# EAGLE design avr_programming_shield_Zif-Ken (EAGLE 6.3)
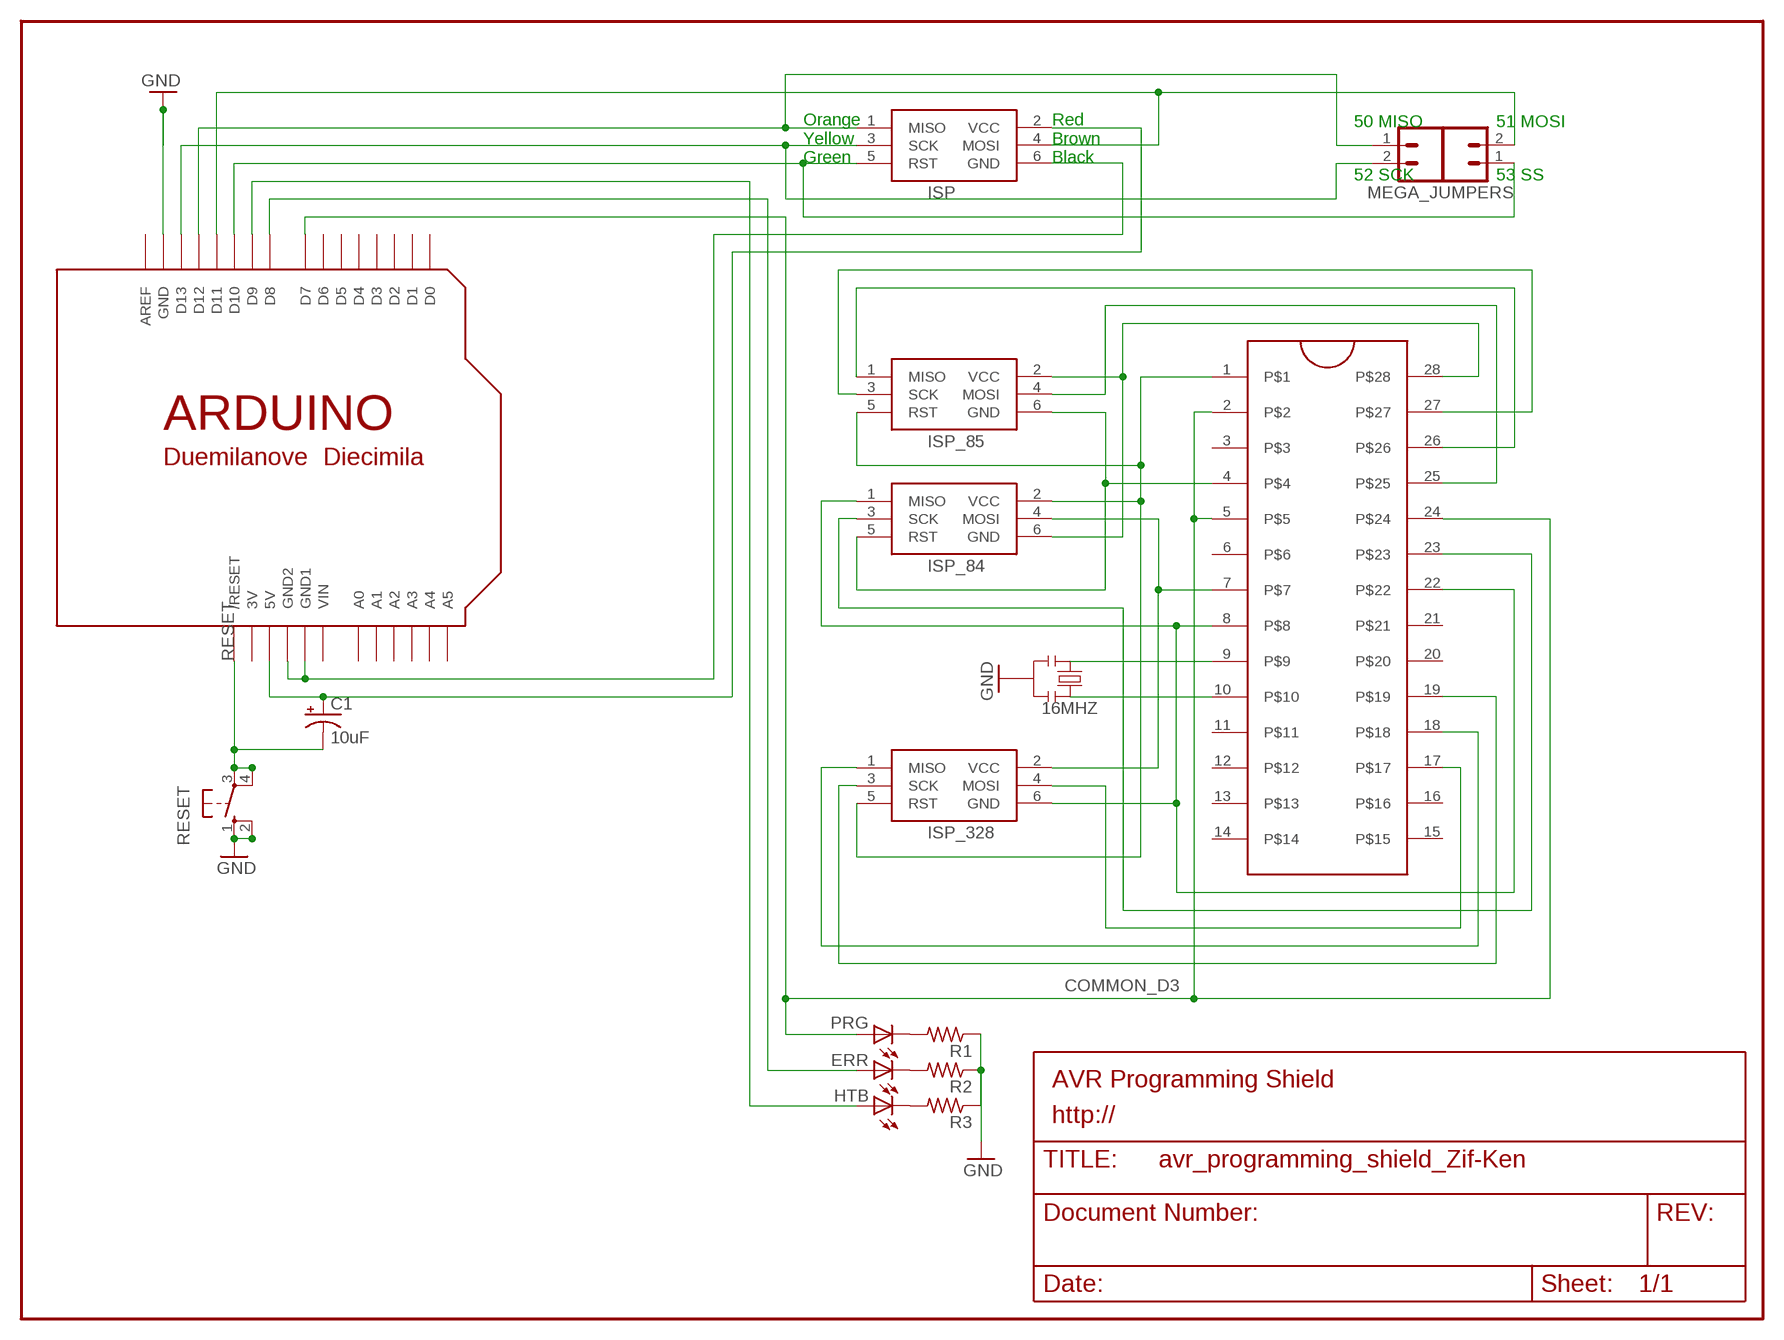
[diagram p0: schematic, sheet 1]

## Parts
16MHZ  RESONATORPTH  [RESONATOR-PTH]
C1  10uF  CAP_POLPTH2  [CPOL-RADIAL-10UF-25V]
ERR  LED3MM  [LED3MM]
HTB  LED3MM  [LED3MM]
ISP  AVRISP-6  [AVRISP]
ISP_84  AVRISP-6  [AVRISP]
ISP_85  AVRISP-6  [AVRISP]
ISP_328  AVRISP-6  [AVRISP]
JP2  M02PTH  [1X02]
MEGA_JUMPERS  M02PTH  [1X02]
PRG  LED3MM  [LED3MM]
R1  R-US_0204/2V  [0204V]
R2  R-US_0204/2V  [0204V]
R3  R-US_0204/2V  [0204V]
RESET  10-XX  [B3F-10XX]
U$1  ARDUINO-NOHOLE  [ARDUINO-NOHOLE]
U$3  ZIFSOCKET-28-3ZIFFSOCKET-28-3  [DIL28-3-ZIF_SOCKET]

## Nets
COMMON_D3: PRG.A U$1.D7 U$3.2 U$3.5 U$3.24
GND [power]: 16MHZ.2 ISP.6(GND) R1.1 R2.1 R3.1 RESET.1(S) RESET.2(S1) U$1.GND U$1.GND1 U$1.GND2
N$1: ISP_328.4(MOSI) U$3.17
N$2: ISP.3(SCK) MEGA_JUMPERS.2 U$1.D13
N$3: ISP.1(MISO) MEGA_JUMPERS.1 U$1.D12
N$4: ISP_328.1(MISO) U$3.18
N$5: ISP.5(RST) JP2.1 U$1.D10
N$6: ISP.4(MOSI) JP2.2 U$1.D11
N$7: ISP_328.3(SCK) U$3.19
N$8: PRG.K(C) R1.2
N$9: ERR.K(C) R2.2
N$10: HTB.K(C) R3.2
N$11: ISP_84.4(MOSI) ISP_328.2(VCC) U$3.7
N$13: ISP_84.2(VCC) ISP_85.5(RST) ISP_328.5(RST) U$3.1
N$15: ISP_84.3(SCK) U$3.23
N$16: ISP_84.6(GND) ISP_85.2(VCC) U$3.28
N$17: HTB.A U$1.D9
N$18: ISP_84.5(RST) ISP_85.6(GND) U$3.4
N$19: ISP_85.4(MOSI) U$3.25
N$20: ISP_85.1(MISO) U$3.26
N$21: ISP_85.3(SCK) U$3.27
N$22: 16MHZ.1 U$3.9
N$24: ERR.A U$1.D8
N$25: 16MHZ.3 U$3.10
N$26: ISP_84.1(MISO) ISP_328.6(GND) U$3.8 U$3.22
RESET: C1.2(-) RESET.3(P) RESET.4(P1) U$1.RESET(/RESET)
VCC: C1.1(+) ISP.2(VCC) U$1.5V
Unconnected: U$1.A0 U$1.A1 U$1.A2 U$1.A3 U$1.A4 U$1.A5 U$1.AREF U$1.D0 U$1.D1 U$1.D2 U$1.D3 U$1.D4 U$1.D5 U$1.D6 U$3.3 U$3.6 U$3.11 U$3.12 U$3.13 U$3.14 U$3.15 U$3.16 U$3.20 U$3.21

## Notes on the sheet
- 50 MISO | 51 MOSI
- Orange
  Yellow
  Green
- Red
  Brown
  Black
- 52 SCK | 53 SS
- AVR Programming Shield
- http://

## Power pins joined to a net without a drawn wire
3V: U$1.3V
VIN: U$1.VIN

## Library data of the parts
16MHZ = SparkFun_mod:RESONATOR: Resonator Small SMD resonator. This is the itty bitty 10/20MHz resonators with built in caps. CSTCE10M0G55 and CSTCE20M0V53. Footprint has been reviewed closely but hasn't been tested yet.
C1 = SparkFun:CAP_POL: Capacitor Polarized These are standard SMD and PTH capacitors. Normally 10uF, 47uF, and 100uF in electrolytic and tantalum varieties. Always verify the external diameter of the through hole cap, it varies with capacity, voltage, and manufacturer. The EIA devices should be standard.
ERR HTB PRG = adafruit:LED: LED OSRAM: - CHIPLED LG R971, LG N971, LY N971, LG Q971, LY Q971, LO R971, LY R971 LH N974, LH R974 LS Q976, LO Q976, LY Q976 LO Q996 - Hyper CHIPLED LW Q18S LB Q993, LB Q99A, LB R99A - SideLED LS A670, LO A670, LY A670, LG A670, LP A670 LB A673, LV A673, LT A673, LW A673 LH A674 LY A675 LS A676, LA A676, LO A676, LY A676, LW A676 LS A679, LY A679, LG A679 - Hyper Micro SIDELED® LS Y876, LA Y876, LO Y876, LY Y876 LT Y87S - SmartLED LW L88C, LW L88S LB L89C, LB L89S, LG L890 LS L89K, LO L89K, LY L89K LS L896, LA L896, LO L896, LY L896 - TOPLED LS T670, LO T670, LY T670, LG T670, LP T670 LSG T670, LSP T670, LSY T670, LOP T670, LYG T670 LG T671, LOG T671, LSG T671 LB T673, LV T673, LT T673, LW T673 LH T674 LS T676, LA T676, LO T676, LY T676, LB T676, LH T676, LSB T676, LW T676 LB T67C, LV T67C, LT T67C, LS T67K, LO T67K, LY T67K, LW E67C LS E67B, LA E67B, LO E67B, LY E67B, LB E67C, LV E67C, LT E67C LW T67C LS T679, LY T679, LG T679 LS T770, LO T770, LY T770, LG T770, LP T770 LB T773, LV T773, LT T773, LW T773 LH T774 LS E675, LA E675, LY E675, LS T675 LS T776, LA T776, LO T776, LY T776, LB T776 LHGB T686 LT T68C, LB T68C - Hyper Mini TOPLED® LB M676 - Mini TOPLED Santana® LG M470 LS M47K, LO M47K, LY M47K Source: http://www.osram.convergy.de/
ISP ISP_84 ISP_85 ISP_328 = adafruit:AVRISP: AVR ISP HEADER Standard 6 pin header for AVR programming
JP2 MEGA_JUMPERS = SparkFun:M02: Header 2 Standard 2-pin 0.1" header. Use with straight break away headers (SKU : PRT-00116), right angle break away headers (PRT-00553), swiss pins (PRT-00743), machine pins (PRT-00117), and female headers (PRT-00115). Molex polarized connector foot print use with SKU : PRT-08233 with associated crimp pins and housings.
R1-R3 = adafruit:R-US_: RESISTOR, American symbol
RESET = switch-omron:10-XX: OMRON SWITCH
U$1 = adafruit:ARDUINO: Arduino Diecimila/Duemilanove Make a shield with ease, this package has all the named pins as well as the two mounting drill holes and an outline of the USB and DC power connector. The outline is on the DIMENSION layer, so if your board house uses it they will cut the outline to match. http://www.ladyada.net/library/pcb/eaglelibrary.html
U$3 = SparkFun-Connectors_mod:ZIFSOCKET-28-3: Lever-action ZIF socket for 28-pin ICs

## Net classes
1 power: width 0.61 mm

## Board
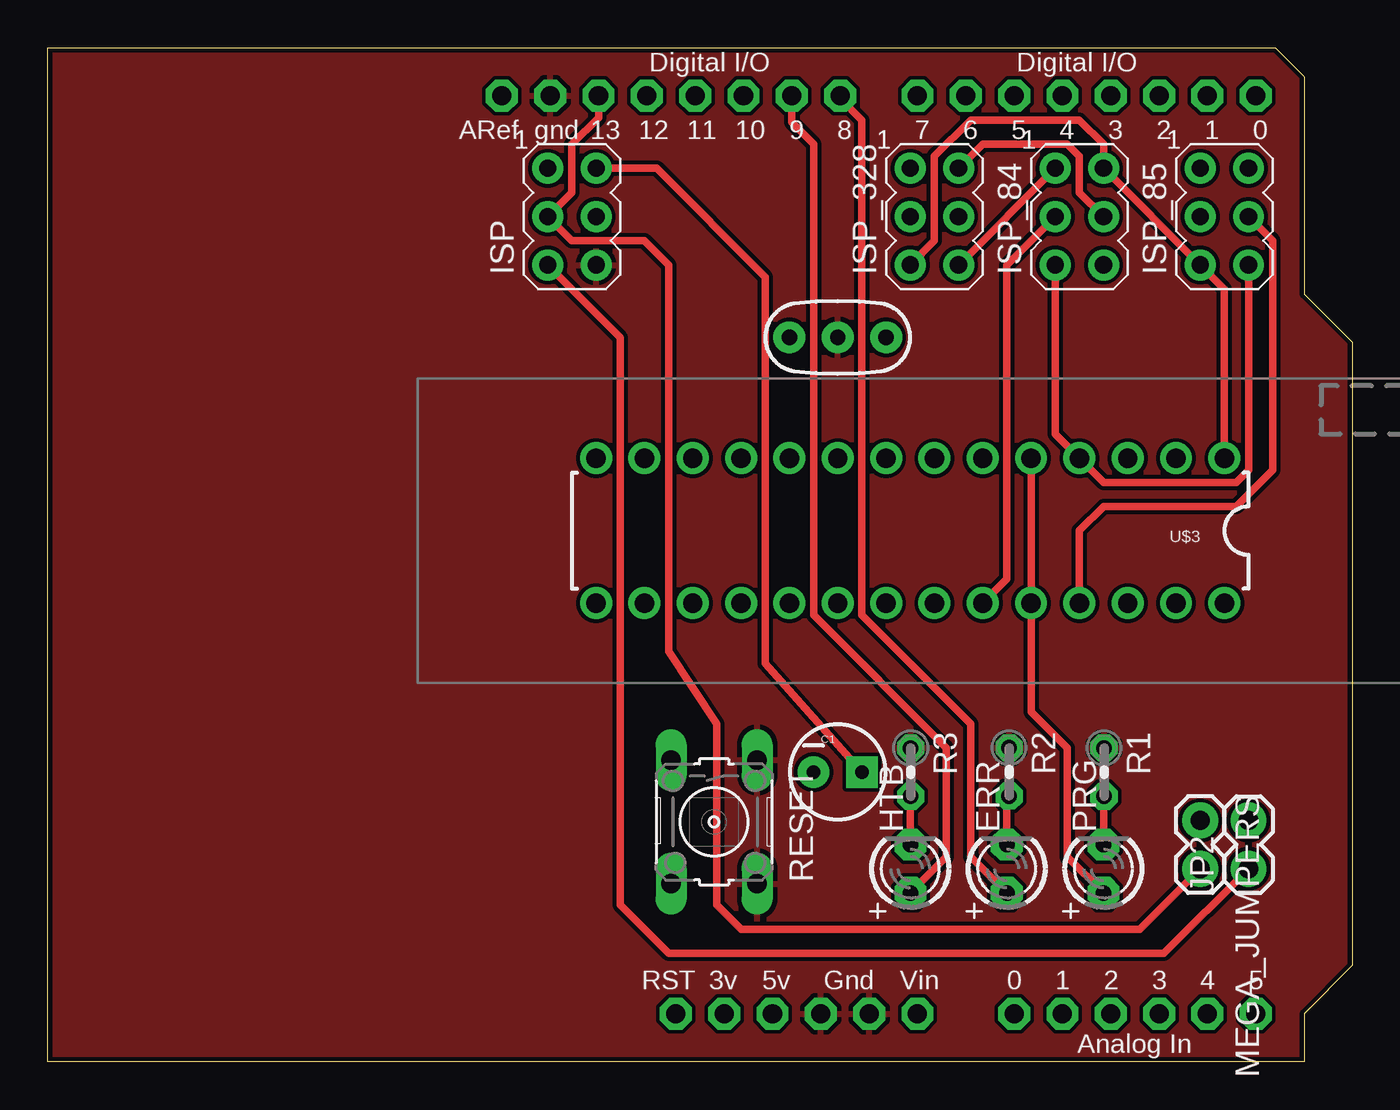
[diagram p1: board, top side]
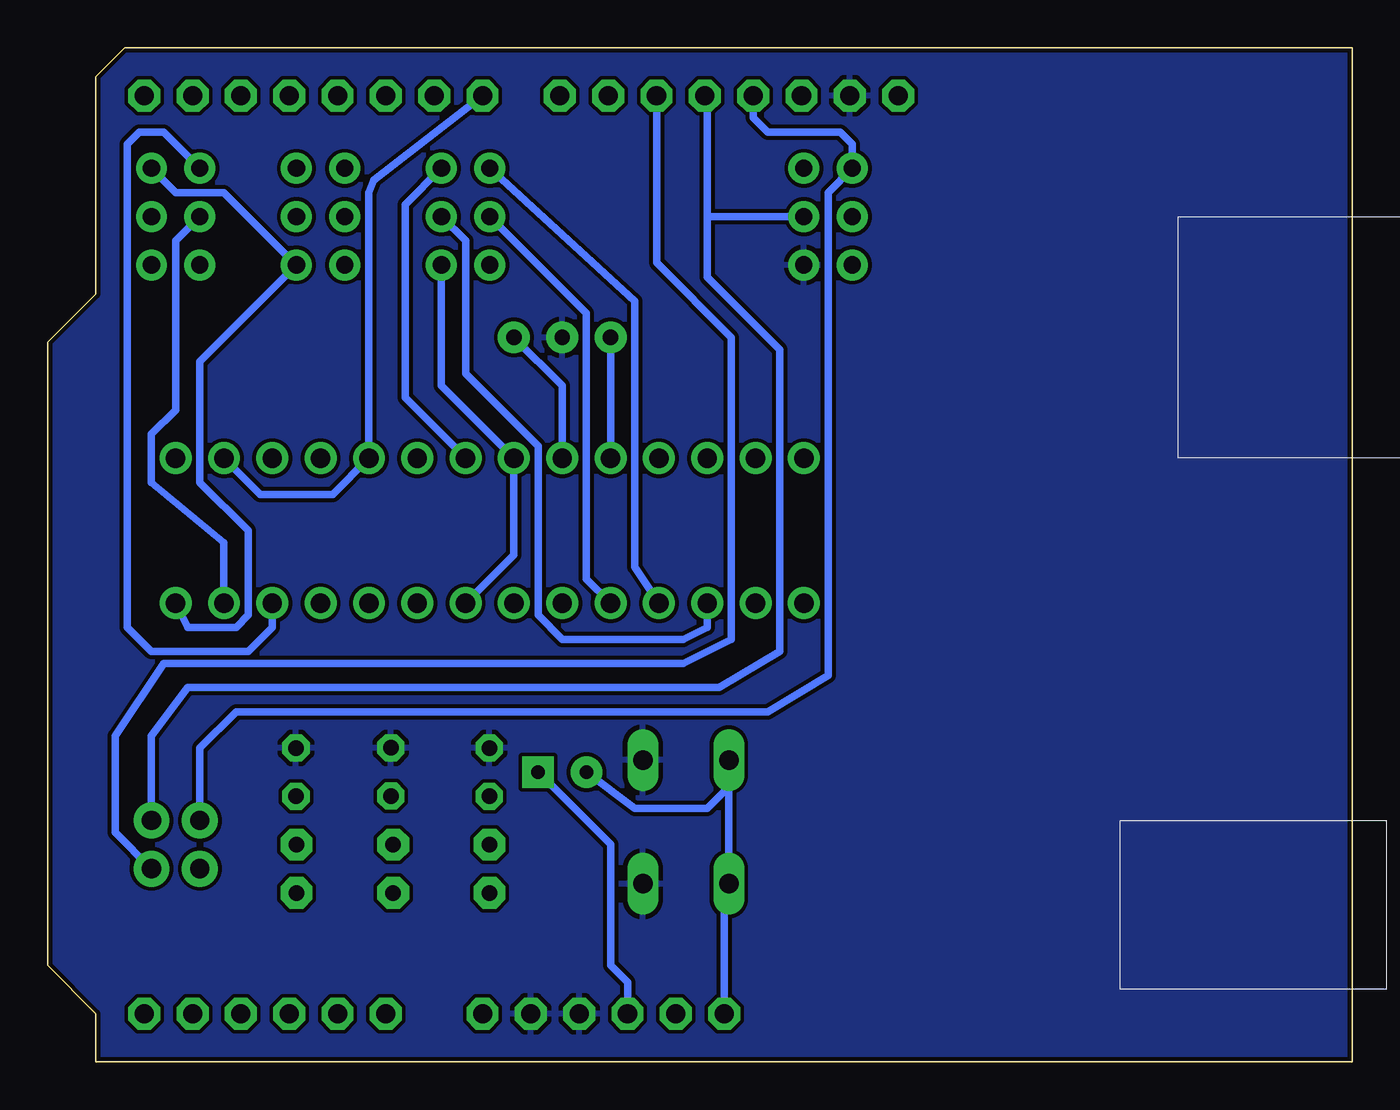
[diagram p2: board, bottom side, seen from below]

Size 68.58 x 53.34 mm. Coordinates in mm from the lower left corner, seen from the top.
Outline: 0,53.34 64.52,53.34 66.04,51.82 66.04,40.39 68.58,37.85 68.58,5.08 66.04,2.54 66.04,0 0,0 0,53.34
Copper layers (1*16): Top 0.035mm / dielectric 1.5mm / Bottom 0.035mm
Design rules "SparkFun": minimum track width 8mil, minimum drill 20mil, track to track 8mil, track to pad 8mil, pad to pad 8mil, via to via 8mil, smd to smd 8mil, copper to edge 10mil, drill to drill 8mil, minimum pad ring 12mil, minimum via ring 10mil, stop-mask expansion 4mil, vias tented up to drill 25mil, thermal gap 10mil

### Footprints (pad centres in the part's own frame; a part is rotated, then mirrored left to right if it is on the bottom)
RESONATOR-PTH = drill 0.8 pad 1.676: 1 -2.54,0; 2 0,0; 3 2.54,0
CPOL-RADIAL-10UF-25V = drill 0.7 pad 1.651 square: 1 1.27,0 | drill 0.7 pad 1.651: 2 -1.27,0
LED3MM = drill 0.813 pad 1.676 octagon: A -1.27,0; K 1.27,0
AVRISP = drill 0.9 pad 1.626: 1 -1.27,2.54; 2 1.27,2.54; 3 -1.27,0; 4 1.27,0; 5 -1.27,-2.54; 6 1.27,-2.54
1X02 = drill 1.016 pad 1.88: 1 0,0; 2 2.54,0
0204V = drill 0.813 octagon: 1 -1.27,0; 2 1.27,0
B3F-10XX = drill 1.016 long: 1 -3.251,2.261; 2 3.251,2.261; 3 -3.251,-2.261; 4 3.251,-2.261
ARDUINO-NOHOLE = drill 1 pad 1.676 octagon: 3V 35.56,2.54; 5V 38.1,2.54; A0 50.8,2.54; A1 53.34,2.54; A2 55.88,2.54; A3 58.42,2.54; A4 60.96,2.54; A5 63.5,2.54; AREF 23.876,50.8; D0 63.5,50.8; D1 60.96,50.8; D2 58.42,50.8; D3 55.88,50.8; D4 53.34,50.8; D5 50.8,50.8; D6 48.26,50.8; D7 45.72,50.8; D8 41.656,50.8; D9 39.116,50.8; D10 36.576,50.8; D11 34.036,50.8; D12 31.496,50.8; D13 28.956,50.8; GND 26.416,50.8; GND1 43.18,2.54; GND2 40.64,2.54; RESET 33.02,2.54; VIN 45.72,2.54
DIL28-3-ZIF_SOCKET = drill 1.016 pad 1.676: 1 -16.51,-3.81; 2 -13.97,-3.81; 3 -11.43,-3.81; 4 -8.89,-3.81; 5 -6.35,-3.81; 6 -3.81,-3.81; 7 -1.27,-3.81; 8 1.27,-3.81; 9 3.81,-3.81; 10 6.35,-3.81; 11 8.89,-3.81; 12 11.43,-3.81; 13 13.97,-3.81; 14 16.51,-3.81; 15 16.51,3.81; 16 13.97,3.81; 17 11.43,3.81; 18 8.89,3.81; 19 6.35,3.81; 20 3.81,3.81; 21 1.27,3.81; 22 -1.27,3.81; 23 -3.81,3.81; 24 -6.35,3.81; 25 -8.89,3.81; 26 -11.43,3.81; 27 -13.97,3.81; 28 -16.51,3.81

### Placement (x,y rotation side)
16MHZ  41.53,38.1 180 top
C1  41.53,15.24 0 top
E$1  [OSHWLOGO_TOL_0.2]  79.12,27.05 0 top  (outside the outline)
ERR  50.42,10.16 90 top
HTB  45.35,10.16 90 top
ISP  27.56,44.45 0 top
ISP_84  54.23,44.45 0 top
ISP_85  61.85,44.45 0 top
ISP_328  46.61,44.45 0 top
JP2  63.12,10.16 90 top
MEGA_JUMPERS  60.58,12.7 270 top
PRG  55.5,10.16 90 top
R1  55.52,15.24 270 top
R2  50.53,15.25 270 top
R3  45.36,15.24 270 top
RESET  35.03,12.62 270 top
U$1  0,0 0 top
U$3  45.34,27.94 180 top

### Tracks (layer width: path | path; a pad name or v marks a point on that pad's centre or on a via)
COMMON_D3
  Top 0.406: U$3.5 U$3.24 51.69,18.41 53.59,16.51 53.59,10.79 PRG.A
  Bottom 0.406: U$3.2 57.4,29.84 53.59,29.84 U$3.5 51.69,45.72 51.44,46.35 U$1.D7
GND
  pour Bottom: 0,53.34 69.22,53.98 69.22,-0.51 0,0
  pour Top: 0,53.34 68.96,53.09 68.71,0.25 0,0.25
N$1
  Bottom 0.406: ISP_328.4 46.61,43.18 46.61,36.2 42.8,32.38 42.8,23.5 41.53,22.23 35.18,22.23 33.91,22.86 U$3.17
N$2
  Top 0.406: U$1.D13 28.96,49.66 27.56,48.26 27.56,45.72 ISP.3 27.56,43.18 31.37,43.18 32.64,41.91 32.64,21.59 35.18,17.78 35.18,8.26 36.45,6.99 57.4,6.99 MEGA_JUMPERS.2
N$3
  Bottom 0.406: U$1.D12 31.5,49.66 30.73,48.9 26.92,48.9 26.29,48.26 ISP.1 27.56,45.72 27.56,20.32 30.73,18.41 58.67,18.41 60.58,16.51 MEGA_JUMPERS.1
N$4
  Bottom 0.406: ISP_328.1 37.72,40.01 37.72,26.04 U$3.18
N$5
  Top 0.406: ISP.5 30.1,38.1 30.1,8.26 32.64,5.71 58.67,5.71 JP2.1
  Bottom 0.406: U$1.D10 36.58,42.04 32.64,38.1 32.64,22.23 35.18,20.95 62.48,20.95 65.02,17.14 65.02,12.06 JP2.1
N$6
  Bottom 0.406: JP2.2 63.12,17.14 61.21,19.68 33.27,19.68 30.1,21.59 30.1,37.47 33.91,41.27 33.91,44.45 | 33.91,44.45 33.91,50.67 U$1.D11 | ISP.4 33.91,44.45
N$7
  Bottom 0.406: ISP_328.3 40.26,39.37 40.26,25.4 U$3.19
N$8
  Top 0.406: PRG.K 55.5,13.95 R1.2
N$9
  Top 0.406: ERR.K 50.42,13.87 R2.2
N$10
  Top 0.406: HTB.K 45.35,13.96 R3.2
N$11
  Top 0.406: ISP_84.4 54.23,45.72 54.23,47.62 53.59,48.26 49.15,48.26 ISP_328.2
  Bottom 0.406: ISP_328.2 49.78,45.09 49.78,34.92 U$3.7
N$13
  Top 0.406: U$3.1 61.85,40.64 ISP_85.5 ISP_84.2 55.5,48.26 54.23,49.53 48.51,49.53 46.61,47.62 46.61,43.18 ISP_328.5
N$15
  Top 0.406: ISP_84.3 50.42,41.91 50.42,25.4 U$3.23
N$16
  Bottom 0.406: U$3.28 61.21,22.86 58.67,22.86 58.04,23.5 58.04,27.94 60.58,30.48 60.58,36.83 ISP_84.6 59.31,45.72 61.85,45.72 ISP_85.2
N$17
  Top 0.406: U$1.D9 39.12,49.4 40.26,48.26 40.26,23.5 47.24,16.51 47.24,10.78 HTB.A
N$18
  Top 0.406: ISP_85.6 63.12,31.11 62.48,30.48 55.5,30.48 U$3.4 52.96,33.02 ISP_84.5
N$19
  Top 0.406: ISP_85.4 64.39,43.18 64.39,31.11 62.48,29.21 55.5,29.21 54.23,27.94 U$3.25
N$20
  Bottom 0.406: U$3.26 56.77,22.86 58.04,21.59 63.12,21.59 64.39,22.86 64.39,48.26 63.75,48.9 62.48,48.9 ISP_85.1
N$21
  Bottom 0.406: ISP_85.3 61.85,43.18 61.85,34.29 63.12,33.02 63.12,30.48 59.31,27.3 U$3.27
N$22
  Bottom 0.406: U$3.9 41.53,35.56 16MHZ.1
N$24
  Top 0.406: U$1.D8 41.66,50.67 42.8,49.53 42.8,23.5 48.51,17.78 48.51,10.79 ERR.A
N$25
  Bottom 0.406: 16MHZ.3 U$3.10
N$26
  Top 0.406: ISP_328.6 ISP_84.1
  Bottom 0.406: ISP_328.6 47.88,35.56 U$3.8 44.07,26.67 U$3.22
RESET
  Bottom 0.406: U$1.RESET 33.02,8.48 RESET.4 RESET.3 32.64,15.75 32.64,14.61 33.91,13.34 37.72,13.34 C1.2
VCC
  Top 0.406: C1.1 37.72,20.95 37.72,41.27 32,46.99 ISP.2
  Bottom 0.406: U$1.5V 38.1,4.19 38.99,5.08 38.99,11.43 C1.1

### Text on the board
bDocu: Avr Programming Shield / Jan 2013